# Altium schematic sheet CL_meter.SchDoc
size A; SheetNumber: 1; SheetTotal: 1
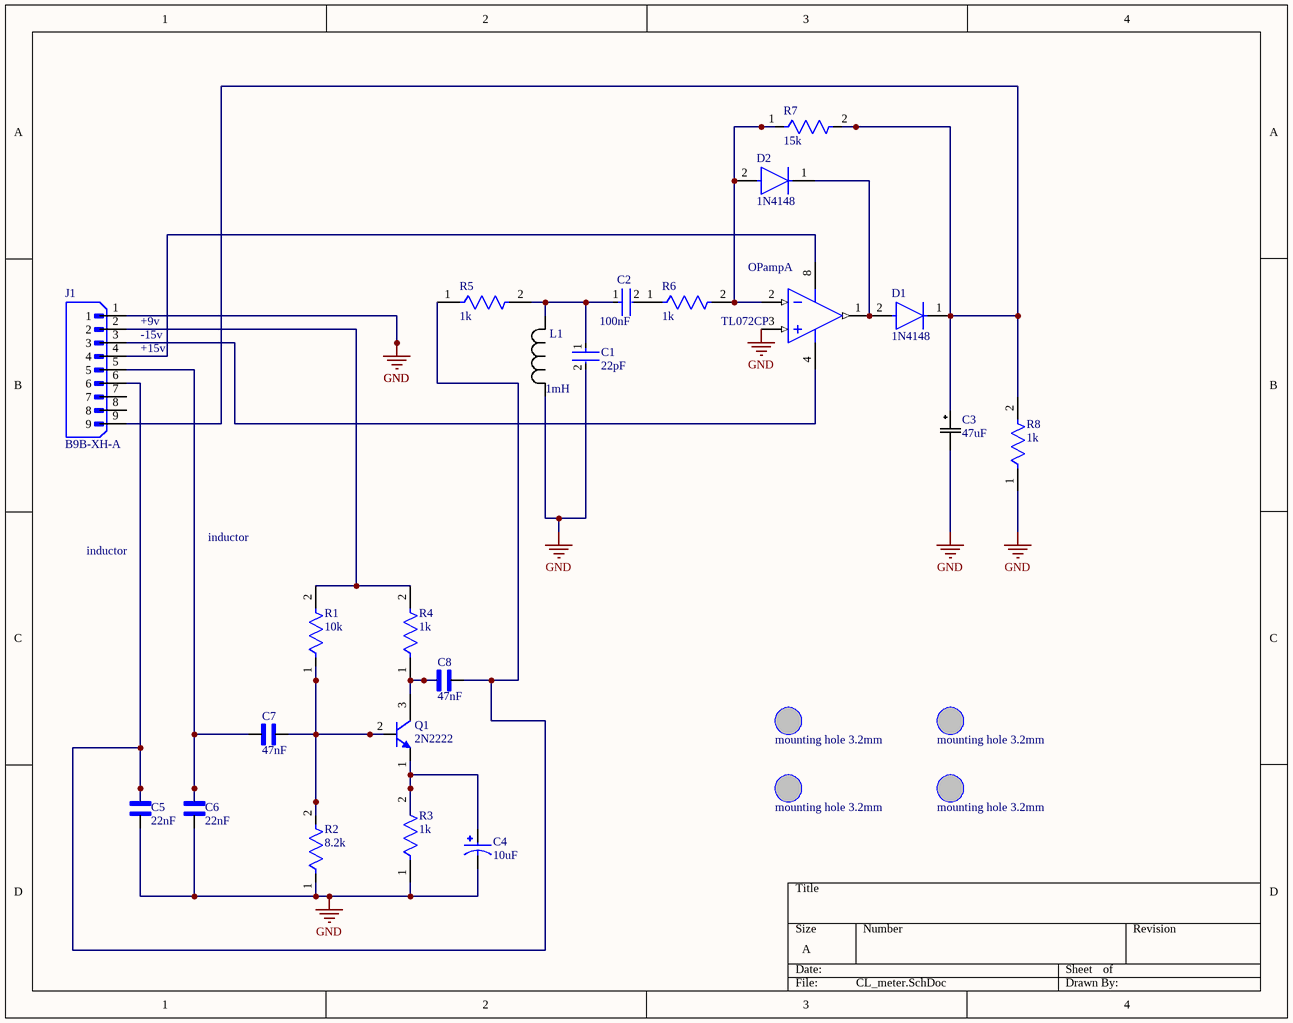
[diagram p0: CL_meter.SchDoc]

## Parts
(Parts that share a designator on the sheet are numbered #1, #2 ... from top to bottom, then left to right.)
C1  22pF  [FP-DE2_D8_T5_F7_5_d0_6-0-MFG]
C2  100nF  [FP-K15H5-MFG]
C3  47uF  [3]
C4  10uF  [10uF]
C5  22nF  [CAPRR254W54L381T254H466]
C6  22nF  [CAPRR254W54L381T254H466]
C7  47nF  [CAPRR254W54L381T254H466]
C8  47nF  [CAPRR254W54L381T254H466]
D1  1N4148  [FP-017AG-MFG]
D2  1N4148  [FP-017AG-MFG]
J1  B9B-XH-A  [JST_B9B-XH-A]
L1  1mH  [IND_BOURNS_RLB9012]
MH#1  mounting hole 3.2mm  [MH]
MH#2  mounting hole 3.2mm  [MH]
MH#3  mounting hole 3.2mm  [MH]
MH#4  mounting hole 3.2mm  [MH]
OPamp  TL072CP  [P0008A]  (part A of 2)
Q1  2N2222  [MLTC-TO-18-3]
R1  10k  [FP-MRS25-MFG]
R2  8.2k  [FP-MRS25-MFG]
R3  1k  [FP-MRS25-MFG]
R4  1k  [FP-MRS25-MFG]
R5  1k  [FP-MRS25-MFG]
R6  1k  [FP-MRS25-MFG]
R7  15k  [FP-MRS25-MFG]
R8  1k  [FP-MRS25-MFG]

## Nets
GND: C1.2 C3.2 C4.N C5.1 C6.1 J1.1 L1.2 OPamp.3(IN1+) R2.1 R3.1 R8.1
NetC1_1: C1.1 C2.1 L1.1 R5.2
NetC2_2: C2.2 R6.1
NetC3_1: C3.1 D1.1(C) J1.9 R7.2 R8.2
NetC4_P: C4.P Q1.1(E) R3.2
NetC5_2: C5.2 C8.2 J1.6 R5.1
NetC6_2: C6.2 C7.1 J1.5
NetC7_2: C7.2 Q1.2(B) R1.1 R2.2
NetC8_1: C8.1 Q1.3(C) R4.1
NetD1_2: D1.2(A) D2.1(C) OPamp.1(OUT1)
NetD2_2: D2.2(A) OPamp.2(IN1-) R6.2 R7.1
NetJ1_2: J1.2 R1.2 R4.2
NetJ1_3: J1.3 OPamp.4(VCC-)
NetJ1_4: J1.4 OPamp.8(VCC+)

Not connected (* = marked no-connect by the designer): J1 7 8

## Notes on the sheet
- (near J1) +9v
- (near J1) -15v
- (near J1) +15v
- inductor

## Library data of the parts
C1 = CMP-00260-30861572-1: DE21XKY220JN3AM02F Cap Ceramic Disc 22pF 250VAC 5% Thru-Hole Ammo Pack; Manufacturer Lifecycle Status: NRND; Ratings: X1, Y2; Lead/Base Style: Straight; Case/Package: Radial; Max Operating Temperature: 85°C; Tolerance: 5%; Lead Pitch: 7.493mm; Min Operating Temperature: 20°C; Packaging: Cut Tape (CT); Capacitance: 22pF; Height - Seated (Max): 10.9982mm; RoHS: Compliant; Lifecycle Status: NRND; NexarPartId: 30861572; Mount: Through Hole
C2 = CMP-02417-000078-1: CAP CER 0.1UF 50V X7R RADIAL; Tolerance: 10%; Dielectric Material: Ceramic; Lead Length: 30mm; Lead Diameter: 0.5mm; Lead/Base Style: Formed Leads; Capacitance: 100nF; Diameter: 500um; Max Operating Temperature: 125°C; Case/Package: Dipped; Dielectric: X7R; Lead Free: Lead Free; Construction: RADIAL; Voltage: 50V; Thickness: 2.6mm; Min Operating Temperature: -55°C; Lead Pitch: 5mm; Height: 4mm; Radiation Hardening: No; Voltage Rating: 50V; Depth: 2.5mm; Voltage Rating (DC): 50V; Package Quantity: 1; Weight: 0.005644oz; Series: K; Mount: Through Hole; Termination: Radial; Height - Seated (Max): 0.257inch; Length: 4mm; Packaging: Tape and Reel; Width: 2.5mm; RoHS Compliant: Yes
C3 = UVK2A470MPD1TD: No Description Available; Mfr_Name: Nichicon
C4 = 10uF: Cap Aluminum Lytic 10uF 25V 20% (4 X 7mm) Radial 5mm 28mA 1000h 85Â°C Ammo Pack; MP: ECEA1EKA100B; MF: Panasonic; Package: RADIAL-2 Panasonic; Check_prices: https://www.snapeda.com/parts/ECEA1EKA100B/Panasonic/view-part/5784962/?ref=eda; Value: *; Price: None; Availability: No availability data; SnapEDA_Link: https://www.snapeda.com/parts/ECEA1EKA100B/Panasonic/view-part/5784962/?ref=snap
C5 C6 = C315C223K5R5TA: 315 C 22nF Ceramic Multilayer Capacitor, 50 VDC, +125degC, X7R Dielec, +/-10% | KEMET C315C223K5R5TA; SnapEDA_Link: https://www.snapeda.com/parts/C315C223K5R5TA/KEMET/view-part/?ref=snap; Package: Radial Kemet; Value: *; MF: KEMET; MP: C315C223K5R5TA; Check_prices: https://www.snapeda.com/parts/C315C223K5R5TA/KEMET/view-part/?ref=eda
C7 C8 = C315C473M5U5TA: 315 C 47nF Ceramic Multilayer Capacitor, 50 VDC, +85degC, Z5U Dielectric, +/-20% | KEMET C315C473M5U5TA; SnapEDA_Link: https://www.snapeda.com/parts/C315C473M5U5TA/KEMET/view-part/?ref=snap; Package: Radial Kemet; Value: *; MF: KEMET; MP: C315C473M5U5TA; Check_prices: https://www.snapeda.com/parts/C315C473M5U5TA/KEMET/view-part/?ref=eda
D1 D2 = CMP-07163-000046-1: DIODE GEN PURP 100V 200MA DO35; Forward Voltage: 1V; Max Power Dissipation: 500mW; Max Reverse Current: 5uA; Forward Current: 300mA; Current: 4A; Reverse Recovery Time: 4ns; Element Configuration: Single; Outside Diameter: 1.85mm; Capacitance: 4pF; Polarity: Standard; Max Forward Surge Current (Ifsm): 1A; Reverse Voltage: 100V; Output Current: 200mA; Average Rectified Current: 200mA; Diameter: 1.91mm; Max Repetitive Reverse Voltage (Vrrm): 100V; Current Rating: 200mA; Case/Package: DO-35; Lead Free: Lead Free; Number of Pins: 2; Recovery Time: 4ns; Packaging: Bulk; Contact Plating: Tin; Voltage: 100V; Mount: Through Hole; Max Surge Current: 4A; Package Quantity: 2000; Width: 1.91mm; Max Reverse Voltage (DC): 100V; Length: 4.56mm; Radiation Hardening: No; Power Dissipation: 500mW; Voltage Rating (DC): 100V; Peak Non-Repetitive Surge Current: 4A; REACH SVHC: No SVHC; Height: 4.56mm; Max Operating Temperature: 175°C; Series: -; Weight: 0.01lb; Min Operating Temperature: -65°C
J1 = B9B-XH-A: MF: {'manufacturer': u'JST Sales America Inc.'}; Package: None; Price: None; Value: *; MP: B9B-XH-A; Availability: Unavailable
L1 = RLB9012-102KL: No Description Available; Mfr_Name: Bourns Electronics
MH#1-MH#4 = MH3P2
OPamp = CMP-0017-00950-2: Dual Low-Noise JFET-Input General-Purpose Operational Amplifier, 7 to 36 V, 0 to 70 degC, 8-pin DIP (P8), Pb-Free (RoHS); Manufacturer: Texas Instruments; Sub Family: General Purpose Amplifier, High Supply Voltage Amplifier (>=30V); Total Supply Voltage(Max)(+5V is 5, +/-5V is 10): 36; Slew Rate(Typ)(V/us): 13; Vn at 1kHz(Typ)(nV/rtHz): 18; GBW(Typ)(MHz): 3; CMRR(Min)(dB): 70; Total Supply Voltage(Min)(+5V is 5, +/-5V is 10): 7; Vio (25C)(Max)(mV): 10; Rating: Catalog; IIB(Max)(pA): 200; Iq per channel(Max)(mA): 2.5; Number of Channels: 2; Mounting Technology: Through Hole; ComponentLink3Description: Package Specification; PartNumber: TL072CP; PackageVersion: 4040082/E, 04/2010; Eco-Plan: Pb-Free (RoHS); DatasheetVersion: SLOS080J; Offset Drift(Typ)(uV/C): 18; ComponentLink3URL: http://www.ti.com/litv/pdf/mpdi001b; PackageDescription: 8-Pin Plastic In-Line, Body 9.59 x 6.35 mm, Pitch 2.54 mm; Code_JEDEC: MS-001; ComponentLink2URL: http://www.ti.com/lit/ds/symlink/tl072.pdf; ComponentLink1Description: Manufacturer URL; ComponentLink2Description: Datasheet; ComponentLink1URL: http://www.ti.com/; PackageReference: P0008A
Q1 = CMP-2000-05237-1: Low Power Bipolar NPN Transistor, 30 V, -65 to 200 degC, 3-Pin TO-18, RoHS, Bulk; Manufacturer: Multicomp; Pin Configuration: a; No. of Pins: 3; No. of Transistors: 1; Collector Emitter Voltage Vces: 400mV; Current Ic Continuous a Max: 800mA; Power Dissipation Pd: 500mW; Collector Emitter Voltage V(br)ceo: 30V; Gain Bandwidth ft Typ: 250MHz; Voltage Vcbo: 60V; DC Current Gain hFE: 100; Full Power Rating Temperature: 25degC; Current Ic @ Vce Sat: 150mA; SVHC: NoSVHC(19-Dec-2012); Package Reference: TO-18-3; Package Description: 3-Pin Transistor Outline Package (TO-18), Dia 5.54 mm, Pitch Pitch 1.485mm; Datasheet URL: http://www.farnell.com/datasheets/1662272.pdf; Transistor Case Style: TO-18; Continuous Collector Current Ic Max: 800mA; Manufacturer URL: http://uk.farnell.com/b/multicomp; DC Collector Current: 800mA; Hfe Min: 100; Transistor Polarity: NPN; Power Dissipation Ptot Max: 500mW; Package / Case: TO-18; Datasheet Version: Rev. 1.1, 05/2012; Gain Bandwidth ft Min: 250MHz; Current Ic hFE: 150mA
R1-R8 = CMP-00030-42757237-1: Max Power Dissipation: 600mW; Resistance: 100Ω; Tolerance: 1%; Voltage Rating: 350V; Temperature Coefficient: 50ppm/°C; Lead Diameter: 600µm; RoHS: Compliant; Radiation Hardening: No; Schedule B: 8533210090, 8533210090; Length: 6.5mm; Packaging: Tape & Reel (TR); Number of Terminations: 2; Mount: Through Hole; Width: 2.5mm; Military Standard: Not; Voltage Rating (DC): 350V; Contact Plating: Tin; Number of Pins: 2; Max Operating Temperature: 155°C; NexarPartId: 42757237; Diameter: 2.5mm; Composition: Metal Film, Thin Film; REACH SVHC: Unknown; Power Rating: 600mW; Lead Free: Lead Free; Termination: Axial; Case/Package: Axial; Min Operating Temperature: -55°C